# EAGLE design ToolheadPCBRemix (EAGLE 9.6.2)
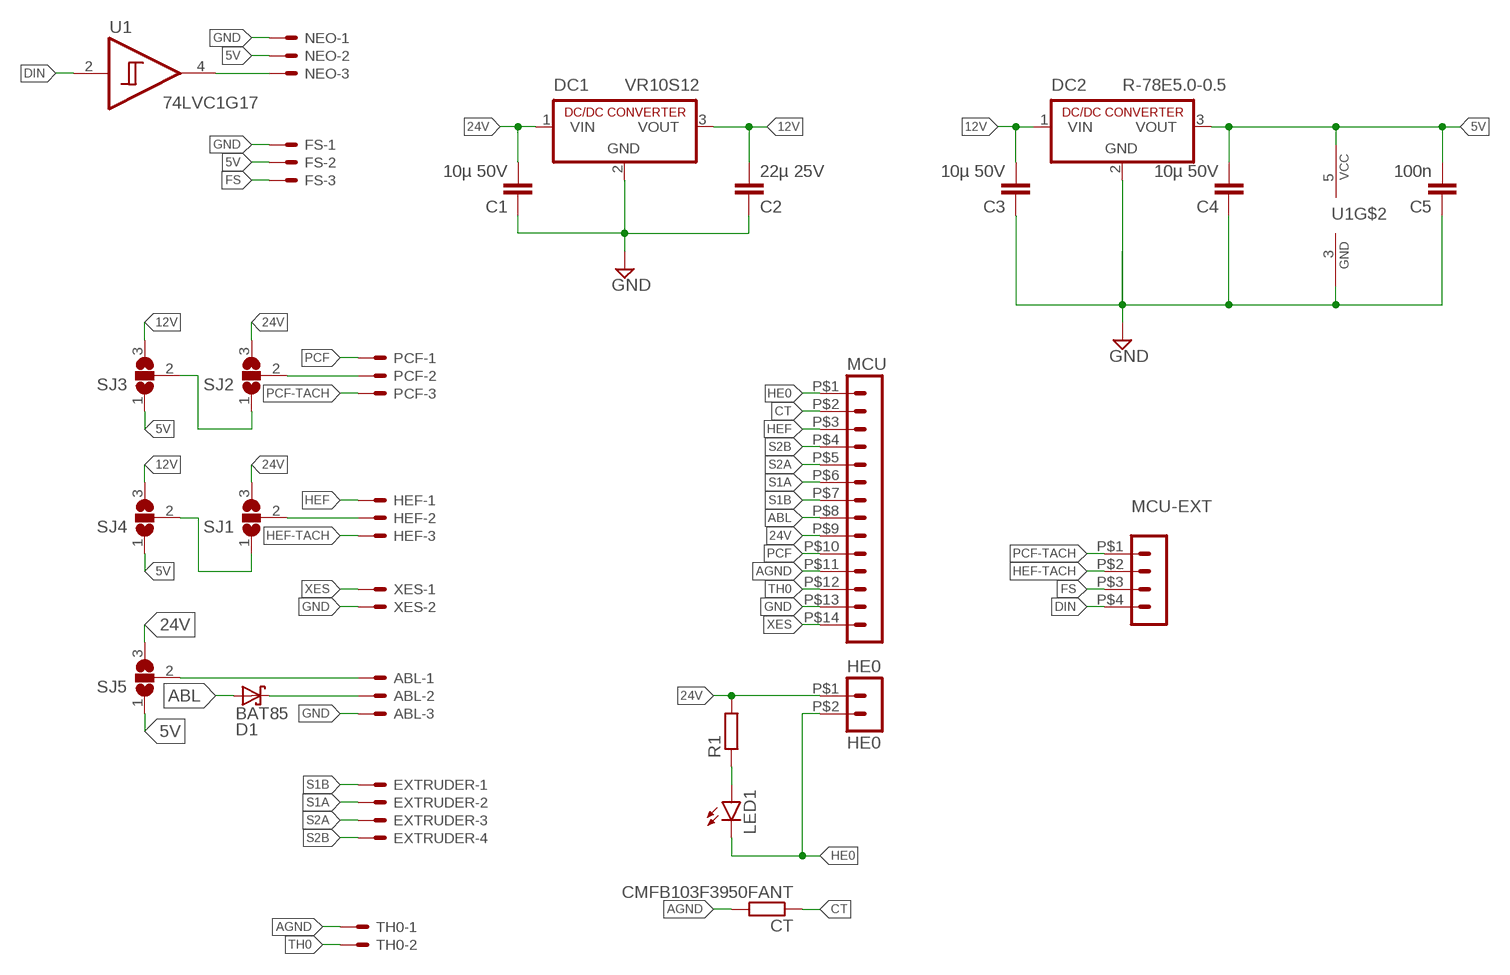
[diagram p0: schematic, sheet 1]

## Parts
ABL  JST-XH-03-PIN-ROUND-PAD  [JST-XH-03-PACKAGE-ROUND-PAD]
C1  10µ 50V  C-EUC1206  [C1206]
C2  22µ 25V  C-EUC1206  [C1206]
C3  10µ 50V  C-EUC1206  [C1206]
C4  10µ 50V  C-EUC1206  [C1206]
C5  100n  C-EUC0805  [C0805]
CT  CMFB103F3950FANT  R-EU_R0805  [R0805]
D1  BAT85  [SOD68]
DC1  VR10S12  R-78C12-1.0  [SIP3]
DC2  R-78E5.0-0.5  R-78C5.0-1.0  [SIP3]
EXTRUDER  JST-XH-04-PIN-ROUND-PAD  [JST-XH-04-PACKAGE-ROUND-PAD]
FS  JST-XH-03-PIN-ROUND-PAD  [JST-XH-03-PACKAGE-ROUND-PAD]
HE0  HE0  HEADER_POS2_43650-0200  [43650-0200]
HEF  JST-XH-03-PIN-ROUND-PAD  [JST-XH-03-PACKAGE-ROUND-PAD]
LED1  LEDCHIPLED_0805  [CHIPLED_0805]
MCU  HEADER_POS14_43045-1400  [43045-1400]
MCU-EXT  HEADER_POS4_43045-0401  [43045-0400]
NEO  JST-XH-03-PIN-ROUND-PAD  [JST-XH-03-PACKAGE-ROUND-PAD]
PCF  JST-XH-03-PIN-ROUND-PAD  [JST-XH-03-PACKAGE-ROUND-PAD]
R1  R-EU_R0805  [R0805]
SJ1  SJ2W  [SJ_2]
SJ2  SJ2W  [SJ_2]
SJ3  SJ2W  [SJ_2]
SJ4  SJ2W  [SJ_2]
SJ5  SJ2W  [SJ_2]
TH0  JST-XH-02-PIN-ROUND-PAD  [JST-XH-02-PACKAGE-ROUND-PAD]
U1  74LVC1G17  [SOT23-5]
XES  JST-XH-02-PIN-ROUND-PAD  [JST-XH-02-PACKAGE-ROUND-PAD]

## Nets
5V [pwr]: C4.2 C5.2 DC2.3(VOUT) FS.2 NEO.2 SJ3.1 SJ4.1 SJ5.1 U1.5(VCC)
12V [pwr]: C2.2 C3.2 DC1.3(VOUT) DC2.1(VIN) SJ3.3 SJ4.3
24V [pwr]: C1.2 DC1.1(VIN) HE0.P$1 MCU.P$9 R1.2 SJ1.3 SJ2.3 SJ5.3
ABL: D1.A MCU.P$8
AGND: CT.2 MCU.P$11 TH0.1
CT: CT.1 MCU.P$2
DIN: MCU-EXT.P$4 U1.2(A)
FS: FS.3 MCU-EXT.P$3
GND [pwr]: ABL.3 C1.1 C2.1 C3.1 C4.1 C5.1 DC1.2(GND) DC2.2(GND) FS.1 MCU.P$13 NEO.1 U1.3(GND) XES.2
HE0 [he0]: HE0.P$2 LED1.C MCU.P$1
HEF [pwr]: HEF.1 MCU.P$3
HEF-TACH: HEF.3 MCU-EXT.P$2
N$1: LED1.A R1.1
N$2: PCF.2 SJ2.2
N$3: HEF.2 SJ1.2
N$4: NEO.3 U1.4(Y)
N$5: SJ2.1 SJ3.2
N$8: SJ1.1 SJ4.2
N$9: ABL.1 SJ5.2
N$10: ABL.2 D1.C(K)
PCF [pwr]: MCU.P$10 PCF.1
PCF-TACH: MCU-EXT.P$1 PCF.3
S1A: EXTRUDER.2 MCU.P$6
S1B: EXTRUDER.1 MCU.P$7
S2A: EXTRUDER.3 MCU.P$5
S2B: EXTRUDER.4 MCU.P$4
TH0: MCU.P$12 TH0.2
XES: MCU.P$14 XES.1

## Library data of the parts
ABL FS HEF NEO PCF = Rembrandt Electronics - JST XH Connectors v1-0:JST-XH-03-PIN: JST XH Connector 2 Pin Wire to board connector. Pitch: 2,54 mm, (0.100") Number of pins: 3 Created by Rembrandt Electronics www.rembrandtelectronics.com
C1-C5 = rcl:C-EU: CAPACITOR, European symbol; SPICEPREFIX: C
CT R1 = rcl:R-EU_: RESISTOR, European symbol; SPICEPREFIX: R
D1 = nxp_60_1_1:BAT85: Schottky barrier diode Planar Schottky barrier diode with an integrated protection ring against static discharges, encapsulated in a hermetically-sealed subminiature SOD68 (DO-34) package. The diode is suitable for mounting on a 2 E (5.08 mm) pitch. AAL Eindhoven MK
DC1 DC2 = dc-dc-converter:R-78C*-1.0: INNOLINE DC/DC-Converter 1.0 AMP SIP3 Single Output Source: Data sheet <http://www.mikrocontroller.net/attachment/150645/157764-da-01-en-DC_DC_WANDLER_R_78C5_0_1_0.pdf>
EXTRUDER = Rembrandt Electronics - JST XH Connectors v1-0:JST-XH-04-PIN: JST XH Connector 2 Pin Wire to board connector. Pitch: 2,54 mm, (0.100") Number of pins: 4 Created by Rembrandt Electronics www.rembrandtelectronics.com
HE0 = con-molex-micro-fit-3_0:HEADER_POS2_?: Molex - Micro-Fit 3.0 Series connector, 3.00mm (0.118") pitch header, 2 positions.
LED1 = led:LED: LED OSRAM: - CHIPLED LG R971, LG N971, LY N971, LG Q971, LY Q971, LO R971, LY R971 LH N974, LH R974 LS Q976, LO Q976, LY Q976 LO Q996 - Hyper CHIPLED LW Q18S LB Q993, LB Q99A, LB R99A - SideLED LS A670, LO A670, LY A670, LG A670, LP A670 LB A673, LV A673, LT A673, LW A673 LH A674 LY A675 LS A676, LA A676, LO A676, LY A676, LW A676 LS A679, LY A679, LG A679 - Hyper Micro SIDELED® LS Y876, LA Y876, LO Y876, LY Y876 LT Y87S - SmartLED LW L88C, LW L88S LB L89C, LB L89S, LG L890 LS L89K, LO L89K, LY L89K LS L896, LA L896, LO L896, LY L896 - TOPLED LS T670, LO T670, LY T670, LG T670, LP T670 LSG T670, LSP T670, LSY T670, LOP T670, LYG T670 LG T671, LOG T671, LSG T671 LB T673, LV T673, LT T673, LW T673 LH T674 LS T676, LA T676, LO T676, LY T676, LB T676, LH T676, LSB T676, LW T676 LB T67C, LV T67C, LT T67C, LS T67K, LO T67K, LY T67K, LW E67C LS E67B, LA E67B, LO E67B, LY E67B, LB E67C, LV E67C, LT E67C LW T67C LS T679, LY T679, LG T679 LS T770, LO T770, LY T770, LG T770, LP T770 LB T773, LV T773, LT T773, LW T773 LH T774 LS E675, LA E675, LY E675, LS T675 LS T776, LA T776, LO T776, LY T776, LB T776 LHGB T686 LT T68C, LB T68C - Hyper Mini TOPLED® LB M676 - Mini TOPLED Santana® LG M470 LS M47K, LO M47K, LY M47K Source: http://www.osram.convergy.de LUXEON: - LUMILED® LXK2-PW12-R00, LXK2-PW12-S00, LXK2-PW14-U00, LXK2-PW14-V00 LXK2-PM12-R00, LXK2-PM12-S00, LXK2-PM14-U00 LXK2-PE12-Q00, LXK2-PE12-R00, LXK2-PE12-S00, LXK2-PE14-T00, LXK2-PE14-U00 LXK2-PB12-K00, LXK2-PB12-L00, LXK2-PB12-M00, LXK2-PB14-N00, LXK2-PB14-P00, LXK2-PB14-Q00 LXK2-PR12-L00, LXK2-PR12-M00, LXK2-PR14-Q00, LXK2-PR14-R00 LXK2-PD12-Q00, LXK2-PD12-R00, LXK2-PD12-S00 LXK2-PH12-R00, LXK2-PH12-S00 LXK2-PL12-P00, LXK2-PL12-Q00, LXK2-PL12-R00 Source: www.luxeon.com KINGBRIGHT: KA-3528ASYC Source: www.kingbright.com
MCU = con-molex-micro-fit-3_0:HEADER_POS14_?: Molex - Micro-Fit 3.0 Series connector, 3.00mm (0.118") pitch header, 14 positions.
MCU-EXT = con-molex-micro-fit-3_0:HEADER_POS4_?: Molex - Micro-Fit 3.0 Series connector, 3.00mm (0.118") pitch header, 4 positions.
SJ1-SJ5 = jumper:SJ2W: SMD solder JUMPER
TH0 XES = Rembrandt Electronics - JST XH Connectors v1-0:JST-XH-02-PIN: JST XH Connector 2 Pin Wire to board connector. Pitch: 2,54 mm, (0.100") Number of pins: 2 Created by Rembrandt Electronics www.rembrandtelectronics.com
U1 = logick:74LVC1G17

## Net classes
1 pwr: width 0.305 mm
2 he0: width 0.305 mm

## Board
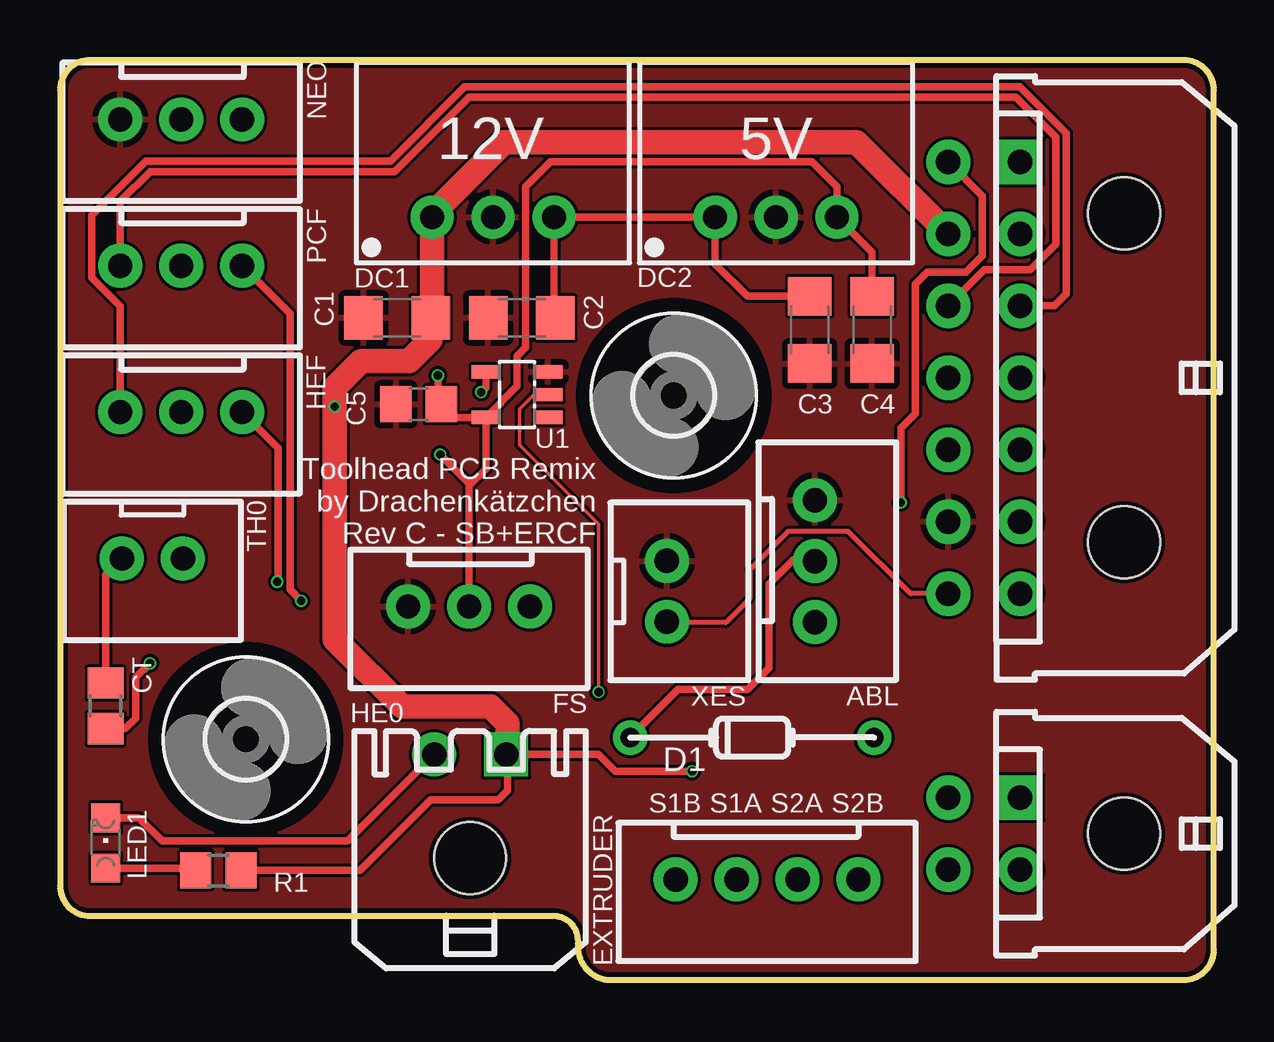
[diagram p1: board, top side]
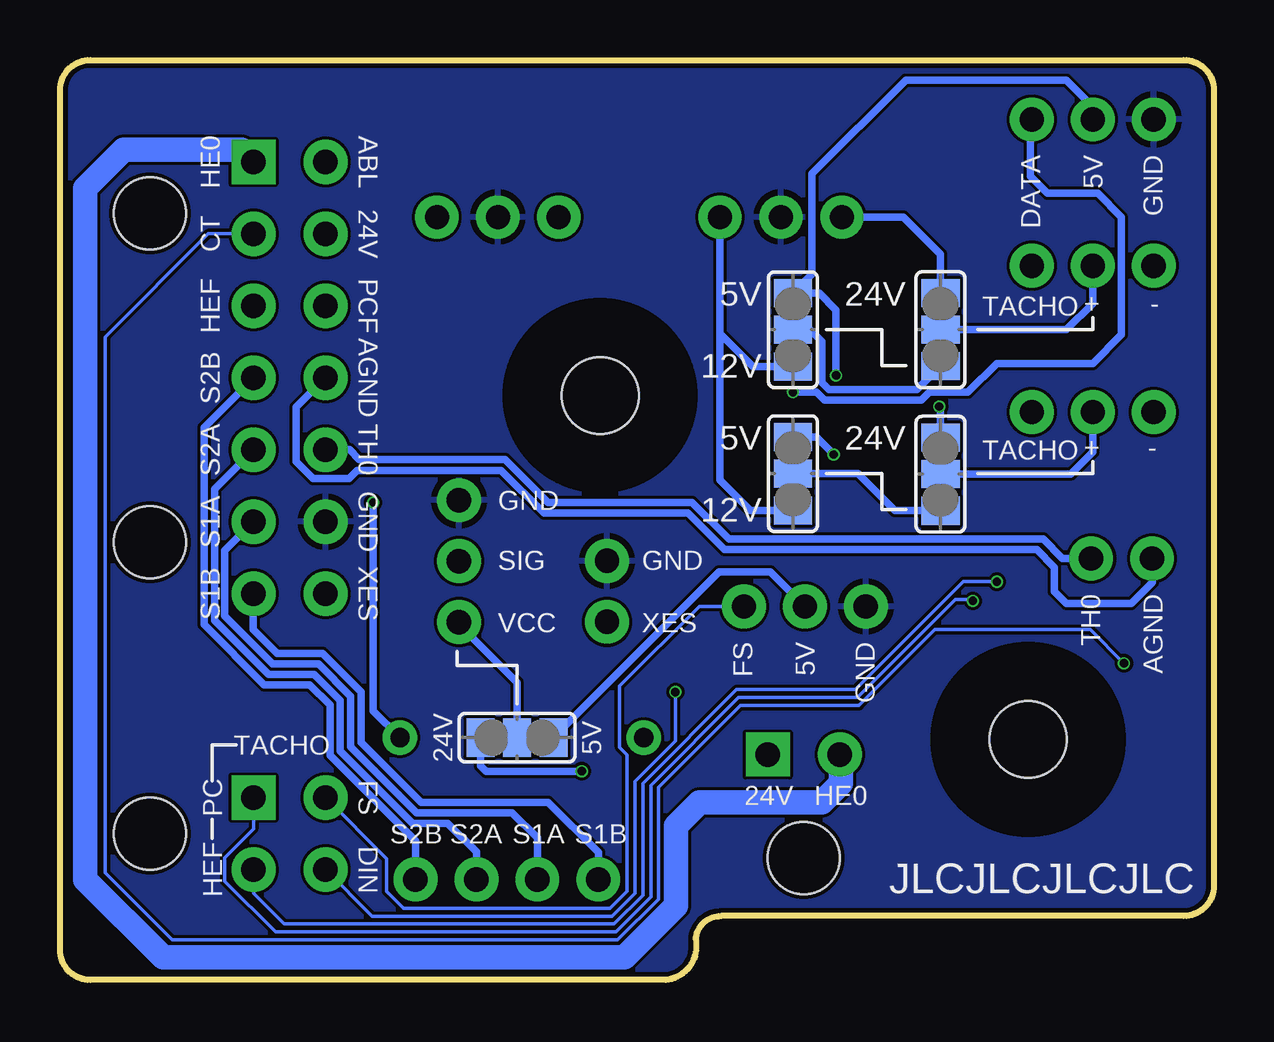
[diagram p2: board, bottom side, seen from below]

Size 48.1 x 38.35 mm. Coordinates in mm from the lower left corner, seen from the top.
Outline: 22.86,0 46.83,0 arc90 48.1,1.27 48.1,37.08 arc90 46.83,38.35 1.27,38.35 arc90 0,37.08 0,3.94 arc90 1.27,2.67 20.55,2.67 arc-90 21.59,1.68 21.59,1.52 arc90 22.86,0
Copper layers (1*16): Top 0.035mm / dielectric 1.6mm / Bottom 0.035mm
Design rules "jlcpcb-2layers": minimum track width 5mil, minimum drill 0.3mm, track to track 5mil, track to pad 5mil, pad to pad 5mil, via to via 5mil, smd to smd 5mil, copper to edge 0.2mm, drill to drill 6mil, minimum pad ring 10mil, minimum via ring 3mil, stop-mask expansion 4mil, vias tented up to drill 0mil, thermal gap 10mil

### Footprints (pad centres in the part's own frame; a part is rotated, then mirrored left to right if it is on the bottom)
JST-XH-03-PACKAGE-ROUND-PAD = drill 1.016: 1 -2.54,1.27; 2 0,1.27; 3 2.54,1.27
C1206 = smd 1.6 x 1.8: 1 -1.4,0; 2 1.4,0
C0805 = smd 1.3 x 1.5: 1 -0.95,0; 2 0.95,0
R0805 = smd 1.3 x 1.5: 1 -0.95,0; 2 0.95,0
SOD68 = drill 0.8 pad 1.422: A -5.08,0; C 5.08,0
SIP3 = drill 1 pad 1.676: 1 -2.54,0; 2 0,0; 3 2.54,0
3,2 = hole 3.2: 0,0
JST-XH-04-PACKAGE-ROUND-PAD = drill 1.016: 1 -3.81,1.27; 2 -1.27,1.27; 3 1.27,1.27; 4 3.81,1.27
43650-0200 = drill 1.02 square: P$1 1.5,4.32 | drill 1.02: P$2 -1.5,4.32 | hole 3: 0,0
CHIPLED_0805 = smd 1.2 x 1.2: A 0,-1.05; C 0,1.05
43045-1400 = drill 1.02 square: P$1 9,4.32 | drill 1.02: P$2 6,4.32; P$3 3,4.32; P$4 0,4.32; P$5 -3,4.32; P$6 -6,4.32; P$7 -9,4.32; P$8 9,7.32; P$9 6,7.32; P$10 3,7.32; P$11 0,7.32; P$12 -3,7.32; P$13 -6,7.32; P$14 -9,7.32 | hole 3: 6.85,0; -6.85,0
43045-0400 = drill 1.02 square: P$1 1.5,4.32 | drill 1.02: P$2 -1.5,4.32; P$3 1.5,7.32; P$4 -1.5,7.32 | hole 3: 0,0
SJ_2 = smd 1.168 x 1.6: 1 -1.524,0; 2 0,0; 3 1.524,0
JST-XH-02-PACKAGE-ROUND-PAD = drill 1.016: 1 -1.27,1.27; 2 1.27,1.27
SOT23-5 = smd 0.55 x 1.2: 1 -0.95,-1.3; 2 0,-1.3; 3 0.95,-1.3; 4 0.95,1.3; 5 -0.95,1.3

### Placement (x,y rotation side)
ABL  32.74,17.46 90 top
C1  14.05,27.6 0 top
C2  19.25,27.6 0 top
C3  31.25,27.1 90 top
C4  33.85,27.1 90 top
C5  14.95,24.01 0 top
CT  1.91,11.43 90 top
D1  28.85,10.1 180 top
DC1  18.05,31.8 0 top
DC2  29.85,31.8 0 top
E$1  [3,2]  7.75,10.03 0 top
E$2  [3,2]  25.58,24.36 0 top
EXTRUDER  29.47,2.92 0 top
FS  17.05,14.3 0 top
HE0  17.09,5.08 0 top
HEF  5.05,22.4 0 top
LED1  1.91,5.71 0 top
MCU  44.35,25.1 90 top
MCU-EXT  44.35,6.1 90 top
NEO  5.05,34.6 0 top
PCF  5.05,28.51 0 top
R1  6.6,4.57 0 top
SJ1  11.4,21.09 90 bottom
SJ2  11.4,27.11 90 bottom
SJ3  17.55,27.1 270 bottom
SJ4  17.55,21.1 270 bottom
SJ5  29.05,10.1 180 bottom
TH0  3.85,16.3 0 top
U1  19.05,24.4 90 top
XES  26.57,16.21 90 top

### Tracks (layer width: path | path; a pad name or v marks a point on that pad's centre or on a via)
5V  (via drill 0.35)
  Top 0.305: C4.2 33.85,30.34 DC2.3 32.39,33.06 31.35,34.1 20.45,34.1 19.41,33.07 19.41,26.37 19.05,26.01 19.05,24.76 U1.5 | U1.5 16.45,23.45 C5.2 15.75,24.15 v15.75,25.2 | FS.2 17.05,20.6 | 17.05,20.6 17.75,21.3 U1.5 | 17.05,20.6 17.05,20.7 v15.85,21.9
  Bottom 0.305: v15.75,25.2 15.75,27.93 16.45,28.63 SJ3.1 16.75,29.43 16.75,33.6 12.85,37.51 6.15,37.51 5.05,36.4 NEO.2 | v15.85,21.9 16.57,22.63 SJ4.1 | FS.2 18.48,17.01 20.63,17.01 SJ5.1
12V
  Top 0.305: C3.2 28.65,28.51 27.31,29.84 DC2.1 DC1.3 20.59,27.66 C2.2
  Bottom 0.305: DC1.3 20.59,27.1 20.59,26.95 | SJ3.3 19.23,25.58 20.59,26.95 | 20.59,26.95 20.59,20.84 19.33,19.58 SJ4.3
24V  (via drill 0.35)
  Top 0.305: 15.51,27.66 C1.2 15.45,26.7 | R1.2 12.52,4.57 15.45,7.5 18.25,7.5 18.65,7.9 18.65,9.34 HE0.P$1 22.46,9.4 23.15,8.7 v26.35,8.7 | DC1.1 15.51,31.93
  Top 1.016: DC1.1 15.51,27.66 | 15.51,31.93 18.51,34.94 33.2,34.94 MCU.P$9 | 15.45,26.7 14.55,25.8 12.55,25.8 11.45,24.7 v11.45,23.9 11.45,14.2 14.25,11.4 17.95,11.4 18.65,10.7 18.65,9.34
  Bottom 0.305: SJ2.3 11.4,30.26 12.95,31.8 DC1.1 | v11.45,23.9 11.4,23.86 SJ1.3 | v26.35,8.7 30.35,8.7 30.57,8.93 SJ5.3
ABL  (via drill 0.35)
  Top 0.305: v35.05,19.9 35.05,23.01 35.65,23.6 35.65,29.01 36.15,29.51 37.75,29.51 38.45,30.2 38.45,32.68 MCU.P$8
  Bottom 0.305: D1.A 35.05,11.22 v35.05,19.9
AGND
  Top 0.305: CT.2 1.91,16.9 TH0.1
  Bottom 0.305: TH0.1 2.58,16.57 3.45,15.7 6.15,15.7 6.65,16.2 6.65,17.2 7.39,17.94 20.4,17.94 21.93,19.47 27.93,19.47 29.71,21.25 35.71,21.25 36.05,20.9 37.55,20.9 38.25,21.6 38.25,23.88 MCU.P$11
CT  (via drill 0.35)
  Top 0.305: CT.1 2.73,10.48 3.15,10.9 3.15,12.6 v3.75,13.2
  Bottom 0.152: MCU.P$2 41.92,31.1 46.22,26.8 46.22,4.46 43.42,1.67 24.85,1.67 23.15,3.37 23.15,8.03 19.74,11.44 14.79,11.44 11.63,14.6 5.15,14.6 v3.75,13.2
DIN  (via drill 0.35)
  Top 0.152: U1.2 19.75,24.4 19.15,23.8 19.15,22.3 22.45,19.01 v22.45,12
  Bottom 0.152: v22.45,12 22.45,9.96 24.14,8.27 24.14,3.62 25.09,2.66 35.09,2.66 MCU-EXT.P$4
FS
  Bottom 0.152: MCU-EXT.P$3 34.48,5.05 34.48,3.7 33.78,3 25.17,3 24.47,3.7 24.47,9.39 24.77,9.69 24.77,12.25 21.45,15.57 FS.3
GND
  pour Bottom: 0,38.65 48.09,38.65 48.09,0 20.85,0 20.85,2.54 0,2.54
  pour Top: 0,38.43 48.35,38.43 48.35,-0.1 0,-0.1
HE0
  Top 0.305: HE0.P$2 12,5.8 4.25,5.8 3.29,6.76 LED1.C
  Bottom 0.305: 15.55,9.36 HE0.P$2
  Bottom 1.016: MCU.P$1 40.53,34.6 45.45,34.6 47.05,33.01 47.05,4.18 43.8,0.94 24.57,0.94 22.42,3.09 22.42,6.44 21.45,7.4 16.35,7.4 15.55,8.2 15.55,9.36
HEF
  Top 0.305: HEF.1 2.51,28.09 1.32,29.28 1.32,31.88 3.57,34.14 13.77,34.14 16.87,37.24 40.02,37.24 41.95,35.3 41.95,28.6 41.45,28.1 MCU.P$3
HEF-TACH  (via drill 0.35)
  Top 0.305: HEF.3 9.09,22.17 9.09,16.65 v9.05,16.6
  Bottom 0.152: MCU-EXT.P$2 40.03,3.61 38.75,2.33 25.01,2.33 23.81,3.54 23.81,8.2 19.9,12.1 14.95,12.1 10.45,16.6 v9.05,16.6
N$1
  Top 0.305: LED1.A 5.56,4.66 R1.1
N$2
  Bottom 0.305: SJ2.2 6.15,27.11 5.05,28.2 PCF.2
N$3
  Bottom 0.305: SJ1.2 5.97,21.09 5.05,22.01 HEF.2
N$4  (via drill 0.35)
  Top 0.305: U1.4 17.75,24.7 v17.55,24.51
  Bottom 0.305: v17.55,24.51 16.56,24.51 16.23,24.17 12.2,24.17 11.87,24.51 10.25,24.51 9.05,25.7 5.05,25.7 3.86,26.9 3.86,31.81 4.85,32.8 6.95,32.8 7.65,33.51 7.65,35.81 NEO.3
N$5
  Bottom 0.305: SJ3.2 16.85,27.1 16.35,26.6 16.35,24.9 16.05,24.6 12.38,24.6 SJ2.1
N$8
  Bottom 0.305: SJ1.1 13.31,19.56 14.85,21.1 SJ4.2
N$9
  Bottom 0.305: ABL.1 31.47,14.83 29.05,12.4 SJ5.2
N$10
  Top 0.305: D1.C 25.77,12.1 28.65,12.1 29.55,13 29.55,16.51 30.55,17.51 31.43,17.51 ABL.2
PCF
  Top 0.305: PCF.1 2.51,32.46 3.75,33.7 13.95,33.7 17.05,36.8 39.84,36.8 41.52,35.13 41.52,30.67 40.45,29.6 38.53,29.6 MCU.P$10
PCF-TACH  (via drill 0.35)
  Top 0.305: v10.05,15.8 9.58,16.27 9.58,27.78 PCF.3
  Bottom 0.152: MCU-EXT.P$1 40.03,6.3 41.23,5.1 41.23,4.11 39.12,2 24.93,2 23.47,3.46 23.47,8.12 19.82,11.77 14.87,11.77 10.77,15.87 10.12,15.87 v10.05,15.8
S1A
  Bottom 0.305: EXTRUDER.2 28.2,5.93 29.25,6.97 33.23,6.97 35.98,9.73 35.98,11.83 37.33,13.17 39.23,13.17 41.23,15.17 41.23,17.9 MCU.P$6
S1B
  Bottom 0.305: EXTRUDER.1 25.66,5.32 27.75,7.4 33.05,7.4 35.55,9.9 35.55,12 37.15,13.6 39.05,13.6 40.05,14.6 40.05,16.09 MCU.P$7
S2A
  Bottom 0.305: EXTRUDER.3 30.74,5.33 31.95,6.54 33.41,6.54 36.41,9.55 36.41,11.65 37.51,12.74 39.41,12.74 41.66,14.99 41.66,20.47 MCU.P$5
S2B
  Bottom 0.305: EXTRUDER.4 33.28,5.81 36.85,9.37 36.85,11.47 37.69,12.31 39.59,12.31 42.09,14.81 42.09,23.04 MCU.P$4
TH0
  Bottom 0.305: TH0.2 6.32,17.57 7.12,18.37 20.22,18.37 21.75,19.9 27.75,19.9 29.55,21.7 35.63,21.7 36.03,22.1 MCU.P$12
XES
  Top 0.203: MCU.P$14 35.45,16.1 32.85,18.7 30.35,18.7 28.75,17.1 28.75,15.9 27.75,14.9 25.33,14.9 XES.1

### Text on the board
tNames: 12V | 5V | Toolhead PCB Remix / by Drachenkätzchen / Rev C - SB+ERCF | HE0 | S1B | S1A | S2A | S2B
bNames: GND | 5V | DATA | ABL | HE0 | 24V | CT | 24V | 5V | - | + | TACHO | PCF | HEF | 12V | AGND | S2B | 24V | 5V | - | + | TACHO | TH0 | S2A | GND | 12V | GND | S1A | GND | SIG | AGND | TH0 | XES | S1B | XES | VCC | GND | 5V | FS | 5V | 24V | TACHO | HE0 | 24V | FS | PC | S1B | S1A | S2A | S2B | DIN | HEF | JLCJLCJLCJLC